# Altium schematic sheet GWC-MCU-002-A - Temps.SchDoc
size 420 x 297 mm; DocumentNumber: 3; SheetNumber: 3; SheetTotal: 3; PageSetup: Record=PageOptions|CenterHorizontal=True|CenterVertical=True|PrintScale=0.96|XCorrection=1.00|YCorrection=1.00|PrintKind=1|BorderSize=5000000|LeftOffset=0|BottomOffset=0|Orientation=2|PaperLength=1000|PaperWidth=1000|Scale=100|PaperSource=15|PrintQuality=600|MediaType=1|DitherType=10|PrintScaleMode=1|PaperKind=A3 (297 x 420 mm)|PaperIndex=8
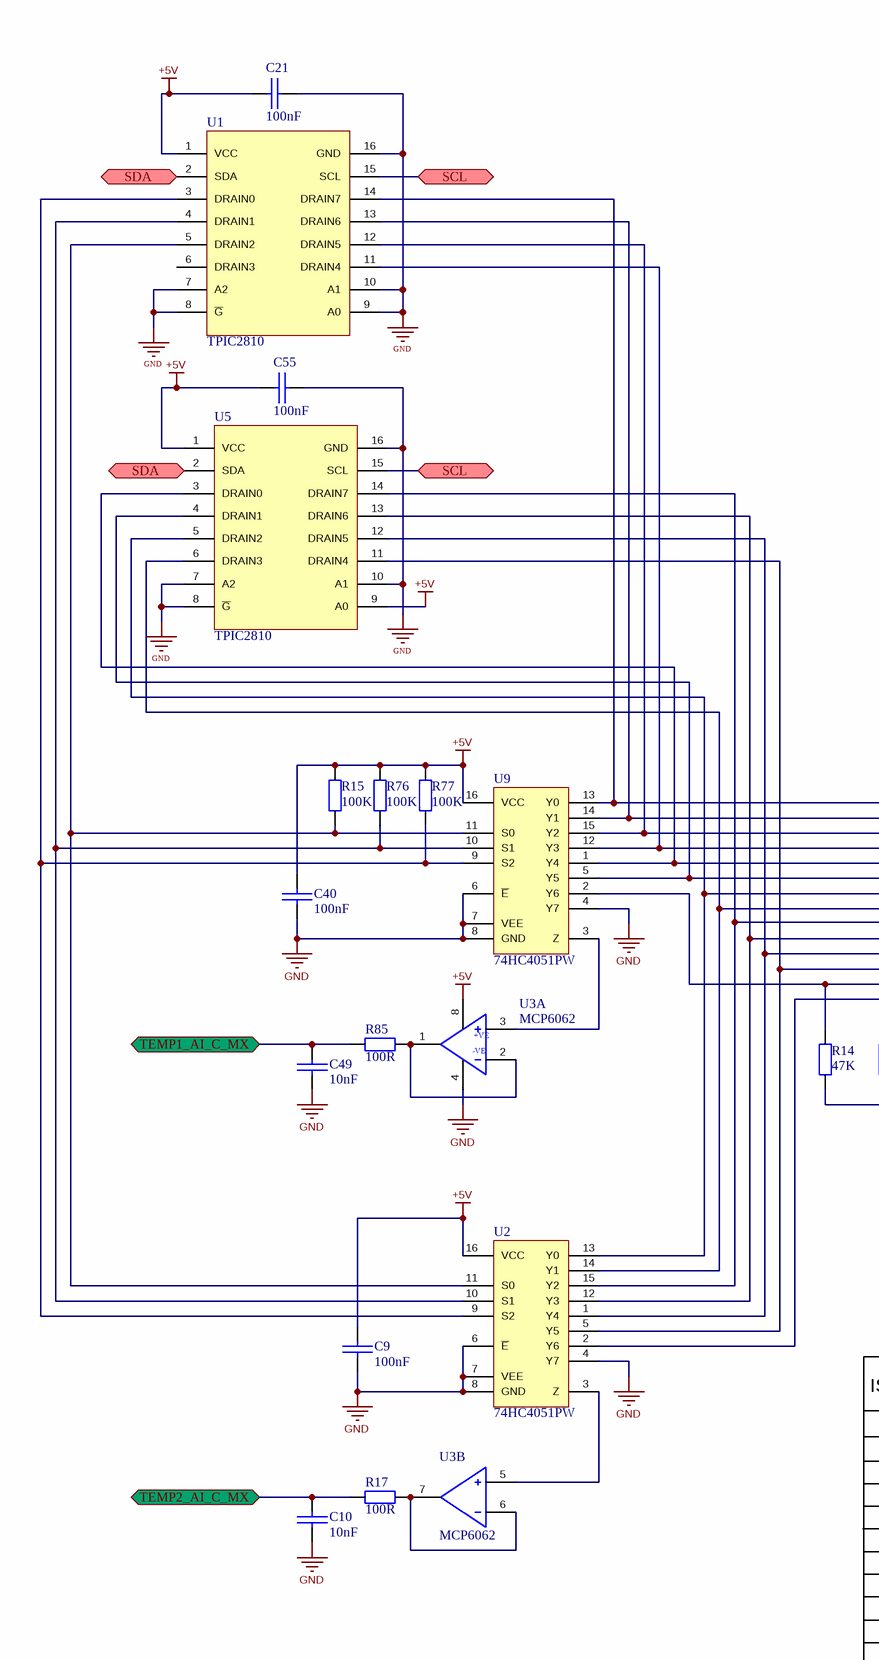
[diagram p0: GWC-MCU-002-A - Temps.SchDoc, left]
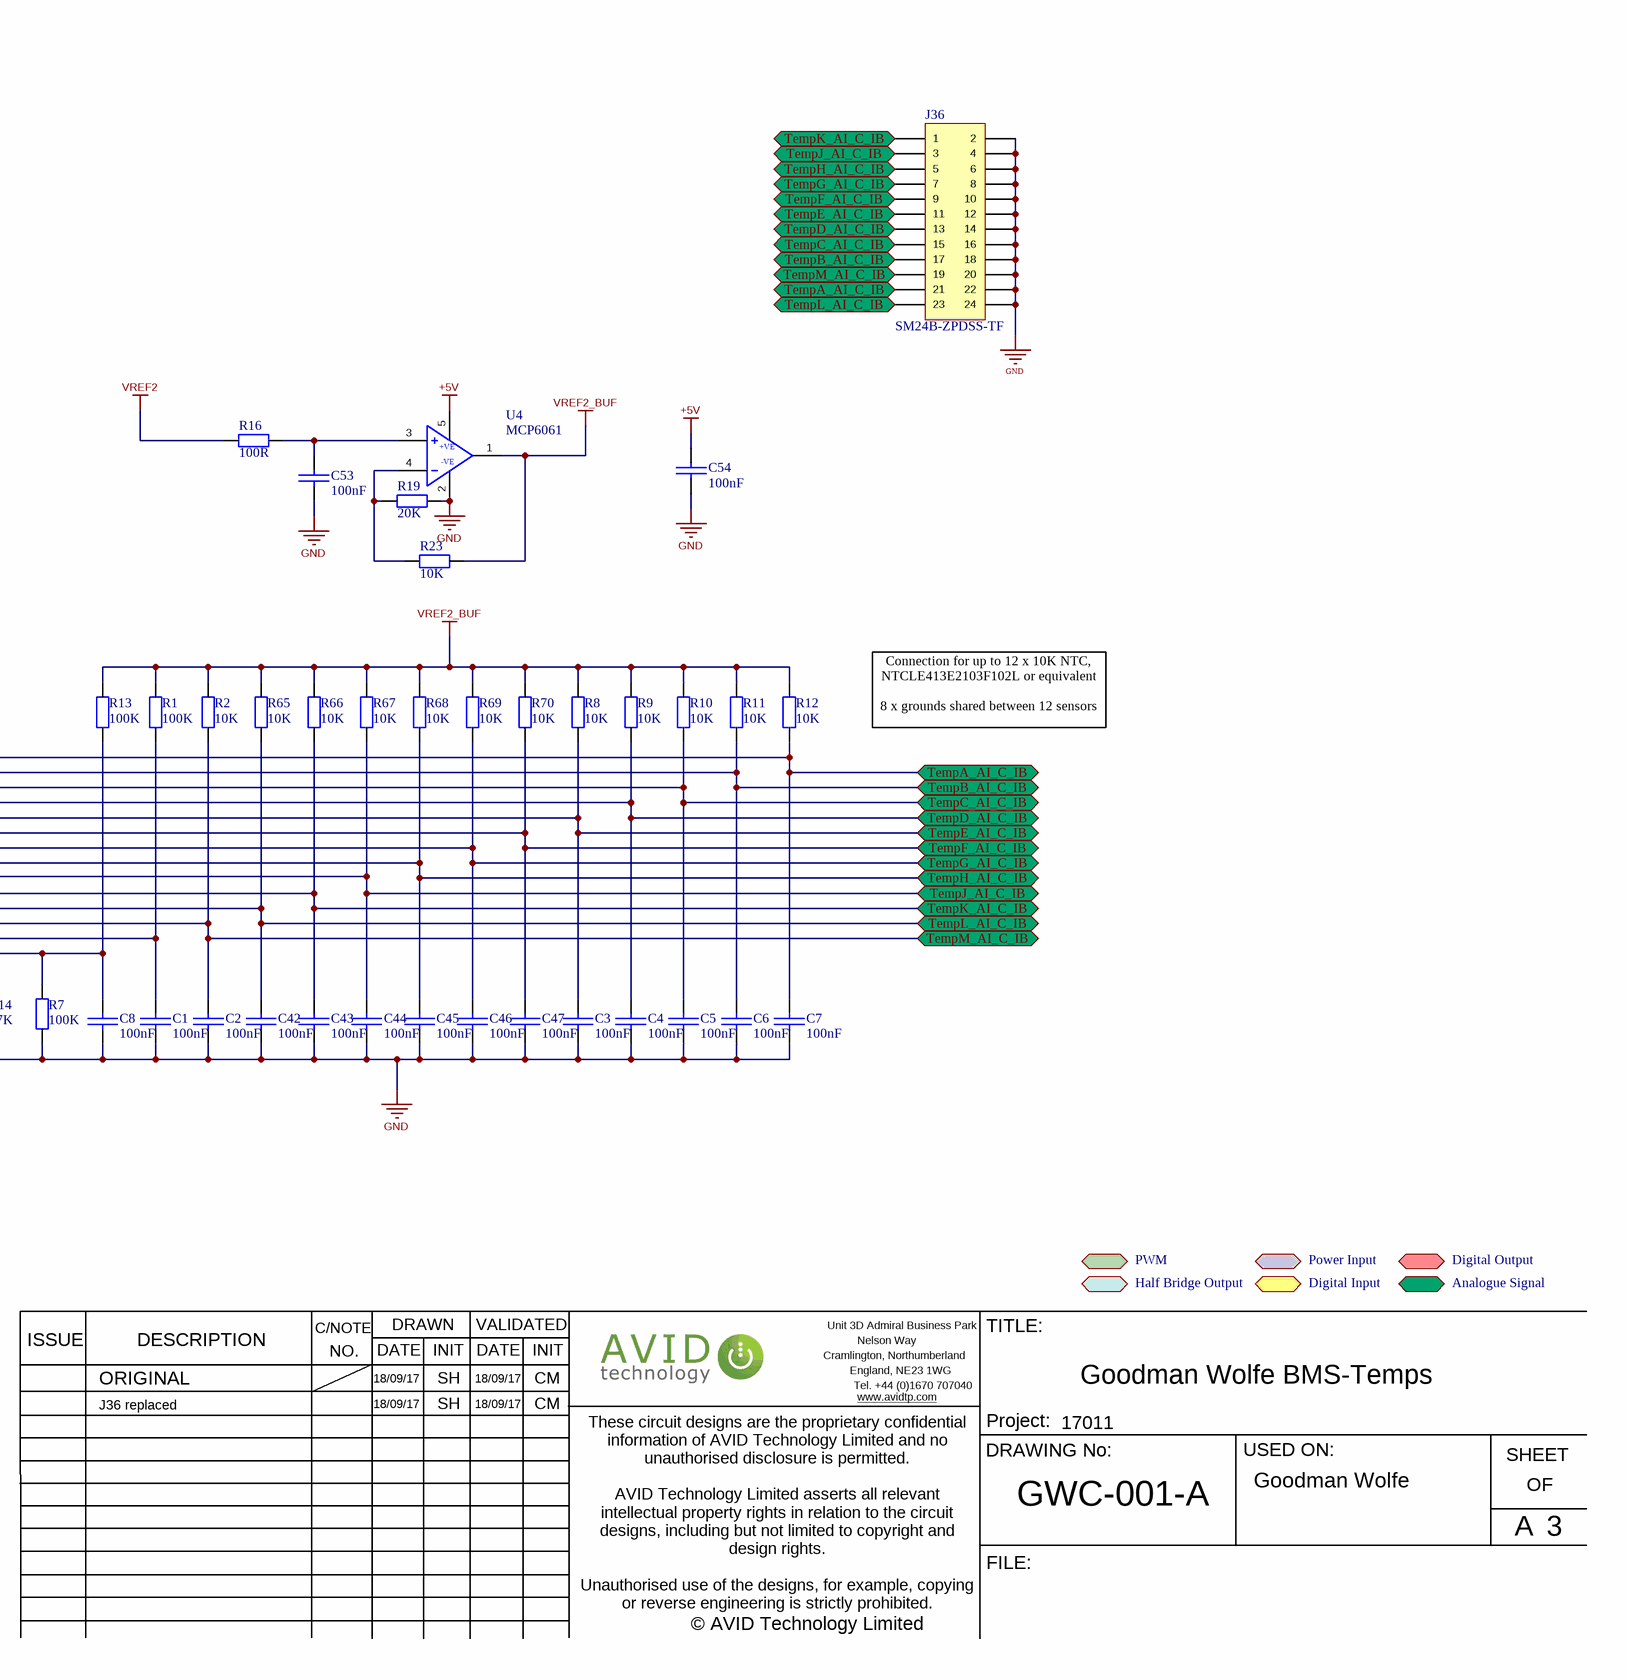
[diagram p1: GWC-MCU-002-A - Temps.SchDoc, right]

## Parts
C1  100nF  [C0603]
C2  100nF  [C0603]
C3  100nF  [C0603]
C4  100nF  [C0603]
C5  100nF  [C0603]
C6  100nF  [C0603]
C7  100nF  [C0603]
C8  100nF  [C0603]
C9  100nF  [C0603]
C10  10nF  [0603]
C21  100nF  [C0603]
C40  100nF  [C0603]
C42  100nF  [C0603]
C43  100nF  [C0603]
C44  100nF  [C0603]
C45  100nF  [C0603]
C46  100nF  [C0603]
C47  100nF  [C0603]
C49  10nF  [0603]
C53  100nF  [C0603]
C54  100nF  [C0603]
C55  100nF  [C0603]
J36  SM24B-ZPDSS-TF  [24 Way ZPD Connecctor]
R1  100K  [0603]
R2  10K  [0603]
R7  100K  [0603]
R8  10K  [0603]
R9  10K  [0603]
R10  10K  [0603]
R11  10K  [0603]
R12  10K  [0603]
R13  100K  [0603]
R14  47K  [0603]
R15  100K  [0603]
R16  100R  [0603]
R17  100R  [0603]
R19  20K  [0603]
R23  10K  [0603]
R65  10K  [0603]
R66  10K  [0603]
R67  10K  [0603]
R68  10K  [0603]
R69  10K  [0603]
R70  10K  [0603]
R76  100K  [0603]
R77  100K  [0603]
R85  100R  [0603]
U1  TPIC2810  [SOIC127P600-TPIC2810]
U2  74HC4051PW  [TSSOP-16]
U3  MCP6062  [SO-8]  (parts A,B of 2)
U4  MCP6061  [SOT-23-5]
U5  TPIC2810  [SOIC127P600-TPIC2810]
U9  74HC4051PW  [TSSOP-16]

## Ports
 (bidir), SCL (bidir), SDA (bidir), TEMP1_AI_C_MX (bidir), TEMP2_AI_C_MX (bidir), TempA_AI_C_IB (bidir), TempB_AI_C_IB (bidir), TempC_AI_C_IB (bidir), TempD_AI_C_IB (bidir), TempE_AI_C_IB (bidir), TempF_AI_C_IB (bidir), TempG_AI_C_IB (bidir), TempH_AI_C_IB (bidir), TempJ_AI_C_IB (bidir), TempK_AI_C_IB (bidir), TempL_AI_C_IB (bidir), TempM_AI_C_IB (bidir)

## Nets
+5V: C9.1 C21.1 C40.1 C54.1 C55.1 R15.1 R76.1 R77.2 U1.1(VCC) U2.16(VCC) U3.8(+VE) U4.5(+VE) U5.1(VCC) U5.9(A0) U9.16(VCC)
GND: C1.1 C2.1 C3.1 C4.1 C5.1 C6.1 C7.1 C8.1 C9.2 C10.2 C21.2 C40.2 C42.1 C43.1 C44.1 C45.1 C46.1 C47.1 C49.2 C53.2 C54.2 C55.2 J36.2 J36.4 J36.6 J36.8 J36.10 J36.12 J36.14 J36.16 J36.18 J36.20 J36.22 J36.24 R7.1 R14.1 R19.2 U1.7(A2) U1.8(~{G}) U1.9(A0) U1.10(A1) U1.16(GND) U2.4(Y7) U2.6(~{E}) U2.7(VEE) U2.8(GND) U3.4(-VE) U4.2(-VE) U5.7(A2) U5.8(~{G}) U5.10(A1) U5.16(GND) U9.4(Y7) U9.6(~{E}) U9.7(VEE) U9.8(GND)
VREF2: R16.1
VREF2_BUF: R1.2 R2.2 R8.2 R9.2 R10.2 R11.2 R12.2 R13.2 R23.2 R65.2 R66.2 R67.2 R68.2 R69.2 R70.2 U4.1(OUT1)
SCL: U1.15(SCL) U5.15(SCL) ; port SCL
SDA: U1.2(SDA) U5.2(SDA) ; port SDA
TEMP1_AI_C_MX: C49.1 R85.1 ; port TEMP1_AI_C_MX
TEMP2_AI_C_MX: C10.1 R17.1 ; port TEMP2_AI_C_MX
TempA_AI_C_IB: C7.2 J36.21 R12.1 U1.14(DRAIN7) U9.13(Y0) ; port TempA_AI_C_IB
TempB_AI_C_IB: C6.2 J36.17 R11.1 U1.13(DRAIN6) U9.14(Y1) ; port TempB_AI_C_IB
TempC_AI_C_IB: C5.2 J36.15 R10.1 U1.12(DRAIN5) U9.15(Y2) ; port TempC_AI_C_IB
TempD_AI_C_IB: C4.2 J36.13 R9.1 U1.11(DRAIN4) U9.12(Y3) ; port TempD_AI_C_IB
TempE_AI_C_IB: C3.2 J36.11 R8.1 U5.3(DRAIN0) U9.1(Y4) ; port TempE_AI_C_IB
TempF_AI_C_IB: C47.2 J36.9 R70.1 U5.4(DRAIN1) U9.5(Y5) ; port TempF_AI_C_IB
TempG_AI_C_IB: C46.2 J36.7 R69.1 U2.13(Y0) U5.5(DRAIN2) ; port TempG_AI_C_IB
TempH_AI_C_IB: C45.2 J36.5 R68.1 U2.14(Y1) U5.6(DRAIN3) ; port TempH_AI_C_IB
TempJ_AI_C_IB: C44.2 J36.3 R67.1 U2.15(Y2) U5.14(DRAIN7) ; port TempJ_AI_C_IB
TempK_AI_C_IB: C43.2 J36.1 R66.1 U2.12(Y3) U5.13(DRAIN6) ; port TempK_AI_C_IB
TempL_AI_C_IB: C42.2 J36.23 R65.1 U2.1(Y4) U5.12(DRAIN5) ; port TempL_AI_C_IB
TempM_AI_C_IB: C2.2 J36.19 R2.1 U2.5(Y5) U5.11(DRAIN4) ; port TempM_AI_C_IB
NetC1_2: C1.2 R1.1 R14.2 U9.2(Y6)
NetC8_2: C8.2 R7.2 R13.1 U2.2(Y6)
NetC53_1: C53.1 R16.2 U4.3(IN1_+)
NetR15_2: R15.2 U1.5(DRAIN2) U2.11(S0) U9.11(S0)
NetR17_2: R17.2 U3.6(IN2_-) U3.7(OUT2)
NetR19_1: R19.1 R23.1 U4.4(IN1_-)
NetR76_2: R76.2 U1.4(DRAIN1) U2.10(S1) U9.10(S1)
NetR77_1: R77.1 U1.3(DRAIN0) U2.9(S2) U9.9(S2)
NetR85_2: R85.2 U3.1(OUT1) U3.2(IN1_-)
NetU2_3: U2.3(Z) U3.5(IN2_+)
NetU3_3: U3.3(IN1_+) U9.3(Z)

Not connected (* = marked no-connect by the designer): U1 6(DRAIN3)

## Notes on the sheet
- Connection for up to 12 x 10K NTC,
  NTCLE413E2103F102L or equivalent
  8 x grounds shared between 12 sensors
- Half Bridge Output
- PWM
- Digital Input
- Power Input
- Digital Output
- Analogue Signal
- ISSUE
- ORIGINAL
- DESCRIPTION
- C/NOTE
- NO.
- DATE
- DRAWN
- 18/09/17
- INIT
- SH
- VALIDATED
- CM
- Cramlington, Northumberland
- Unit 3D Admiral Business Park
- England, NE23 1WG
- Tel. +44 (0)1670 707040
- Nelson Way
- www.avidtp.com
- TITLE:
- Goodman Wolfe BMS-Temps
- J36 replaced
- DRAWING No:
- Project:
- 17011
- USED ON:
- SHEET
- GWC-001-A
- Goodman Wolfe
- A
- OF
- 3
- © AVID Technology Limited
- FILE:
- These circuit designs are the proprietary confidential information of AVID Technology Limited and no unauthorised disclosure is permitted.
  AVID Technology Limited asserts all relevant intellectual property rights in relation to the circuit designs, including but not limited to copyright and design rights.
  Unauthorised use of the designs, for example, copying or reverse engineering is strictly prohibited.

## Library data of the parts
C1-C9 C21 C40 C42-C47 C53-C55 = 100nF X7R 0603: 100nF 0603 Non Polarised Capacitor; Manufacturer: Kemet; Part Number: C0603C104K5RAC; Tolerance: 10%; Specification: X7R 50V; Component Type: SMD; Supplier: Farnell; Supplier No.: 128-8255; Supplier 1: Farnell; Supplier 2: Digi-Key; Supplier 3: Arrow; Supplier 4: Newark; Supplier Part Number 1: 1288255; Supplier Part Number 2: 399-5089-1-ND; Supplier Part Number 3: 13owRFewPNmjSPXc-JuBeSWHfU3DuBufwBIDEpzGmQ0; Supplier Part Number 4: 72J5992
C10 C49 = 10nF 0603 X7R: 10nF Non Polarised Capacitor; Manufacturer: Kemet; Part Number: C0603C103K5RACTU; Tolerance: 10%; Specification: X7R 50V; Component Type: SMD; Supplier: Farnell; Supplier No.: 141-4609; Supplier 1: Farnell; Supplier 2: Digi-Key; Supplier Part Number 1: 1414609; Supplier Part Number 2: 399-1091-1-ND
J36 = Header 12X2: Header, 24-Pin, Dual row, SM24B-ZPDSS-TF; LatestRevisionDate: 17-Jul-2002; LatestRevisionNote: Re-released for DXP Platform.; Publisher: Altium Limited
R1 R7 R13 R15 R76 R77 = 100K 0603 Resistor: Manufacturer: Phycomp; Part Number: RC0603FR-07100KL; Tolerance: 1%; Specification: 0.063W 50V; Component Type: SMD; Supplier: Farnell; Supplier No.: 111-7236; Supplier 1: Farnell; Supplier Part Number 1: 1117236; Supplier 2: RS-Components; Supplier 3: Digi-Key; Supplier 4: TME; Supplier 5: Newark; Supplier Part Number 2: 504-8940; Supplier Part Number 3: 311-100KHRCT-ND; Supplier Part Number 4: RC0603FR-07100K; Supplier Part Number 5: 68R0051
R2 R8-R12 R65-R70 = 10K 0603 Resistor: Manufacturer: Phycomp; Part Number: 2322 7046 1003; Tolerance: 1%; Specification: 0.063W 50V; Component Type: SMD; Supplier: Farnell; Supplier No.: 111-7235; Supplier 1: Farnell; Supplier Part Number 1: 1117235
R14 = 47K 0603 Resistor: Manufacturer: Phycomp; Part Number: 2322 7046 4703; Tolerance: 1%; Specification: 0.1W 50V; Component Type: SMD; Supplier: Farnell; Supplier No.: 923-8689; Supplier 1: Farnell; Supplier Part Number 1: 9238689
R16 R17 R19 R23 R85 = 100R 0603 Resistor: Manufacturer: Multicomp; Part Number: MC 0.063W 0603 1% 100R; Tolerance: 1%; Specification: 0.063W 50V; Component Type: SMD; Supplier: Farnell; Supplier No.: 933-0364; Supplier 1: Farnell; Supplier Part Number 1: 9330364
U1 U5 = TPIC2810: TPIC2810D -  Led Driver, 8 Outputs, I2C, 3V-5.5V; Manufacturer: Texas; Specification: -40/+85 deg C; Part Number: TPIC2810; Component Type: SMD; Supplier: Farnell; Supplier No.: 1648761; Supplier 1: Mouser; Supplier 2: Digi-Key; Supplier Part Number 1: 595-TPIC2810D; Supplier Part Number 2: 296-21426-5-ND
U2 U9 = 74HC4051PW: 8 Channel Analogue Switch; Manufacturer: NXP; Part Number: 74HC4051PW-Q100,11; Specification: -40/+125 deg C; Component Type: SMD; Supplier: Farnell; Supplier No.: 244-5304; Supplier 1: Farnell; Supplier 2: Mouser; Supplier 3: Digi-Key; Supplier Part Number 1: 2445304; Supplier Part Number 2: 771-74HC4051PW-Q100; Supplier Part Number 3: 568-10114-1-ND
U3 = MCP6062: Dual Opamp; Manufacturer: Microchip; Part Number: MCP6062-E/SN; Specification: -40 to +125; Component Type: SMD; Supplier: Farnell; Supplier No.: 182-5029
U4 = MCP6061: Micropower CMOS Op Amp; Manufacturer: Microchip; Part Number: MCP6061T-E/OT; Specification: Rail to rail In&Out, low Vos; Component Type: SMD; Supplier: Farnell; Supplier No.: 186-3959; Supplier 1: Farnell; Supplier 2: Digi-Key; Supplier 3: Newark; Supplier Part Number 1: 1863959; Supplier Part Number 2: MCP6061T-E/OTCT-ND; Supplier Part Number 3: 23T2817